# Altium schematic sheet AnchorBoard_SNS_Power.SchDoc
size A3; Date: 25.03.2015; Author: bunto1; DrawnBy: bunto1; Organization: BFH; Address1: Berner Fachhochschule; Address2: Technik und Informatik; Address3: Höheweg 80; Address4: 2501 Biel/Bienne; DocumentNumber: 1; Revision: 1.1; SheetNumber: 1; SheetTotal: 2; CurrentDate: 25.03.2016
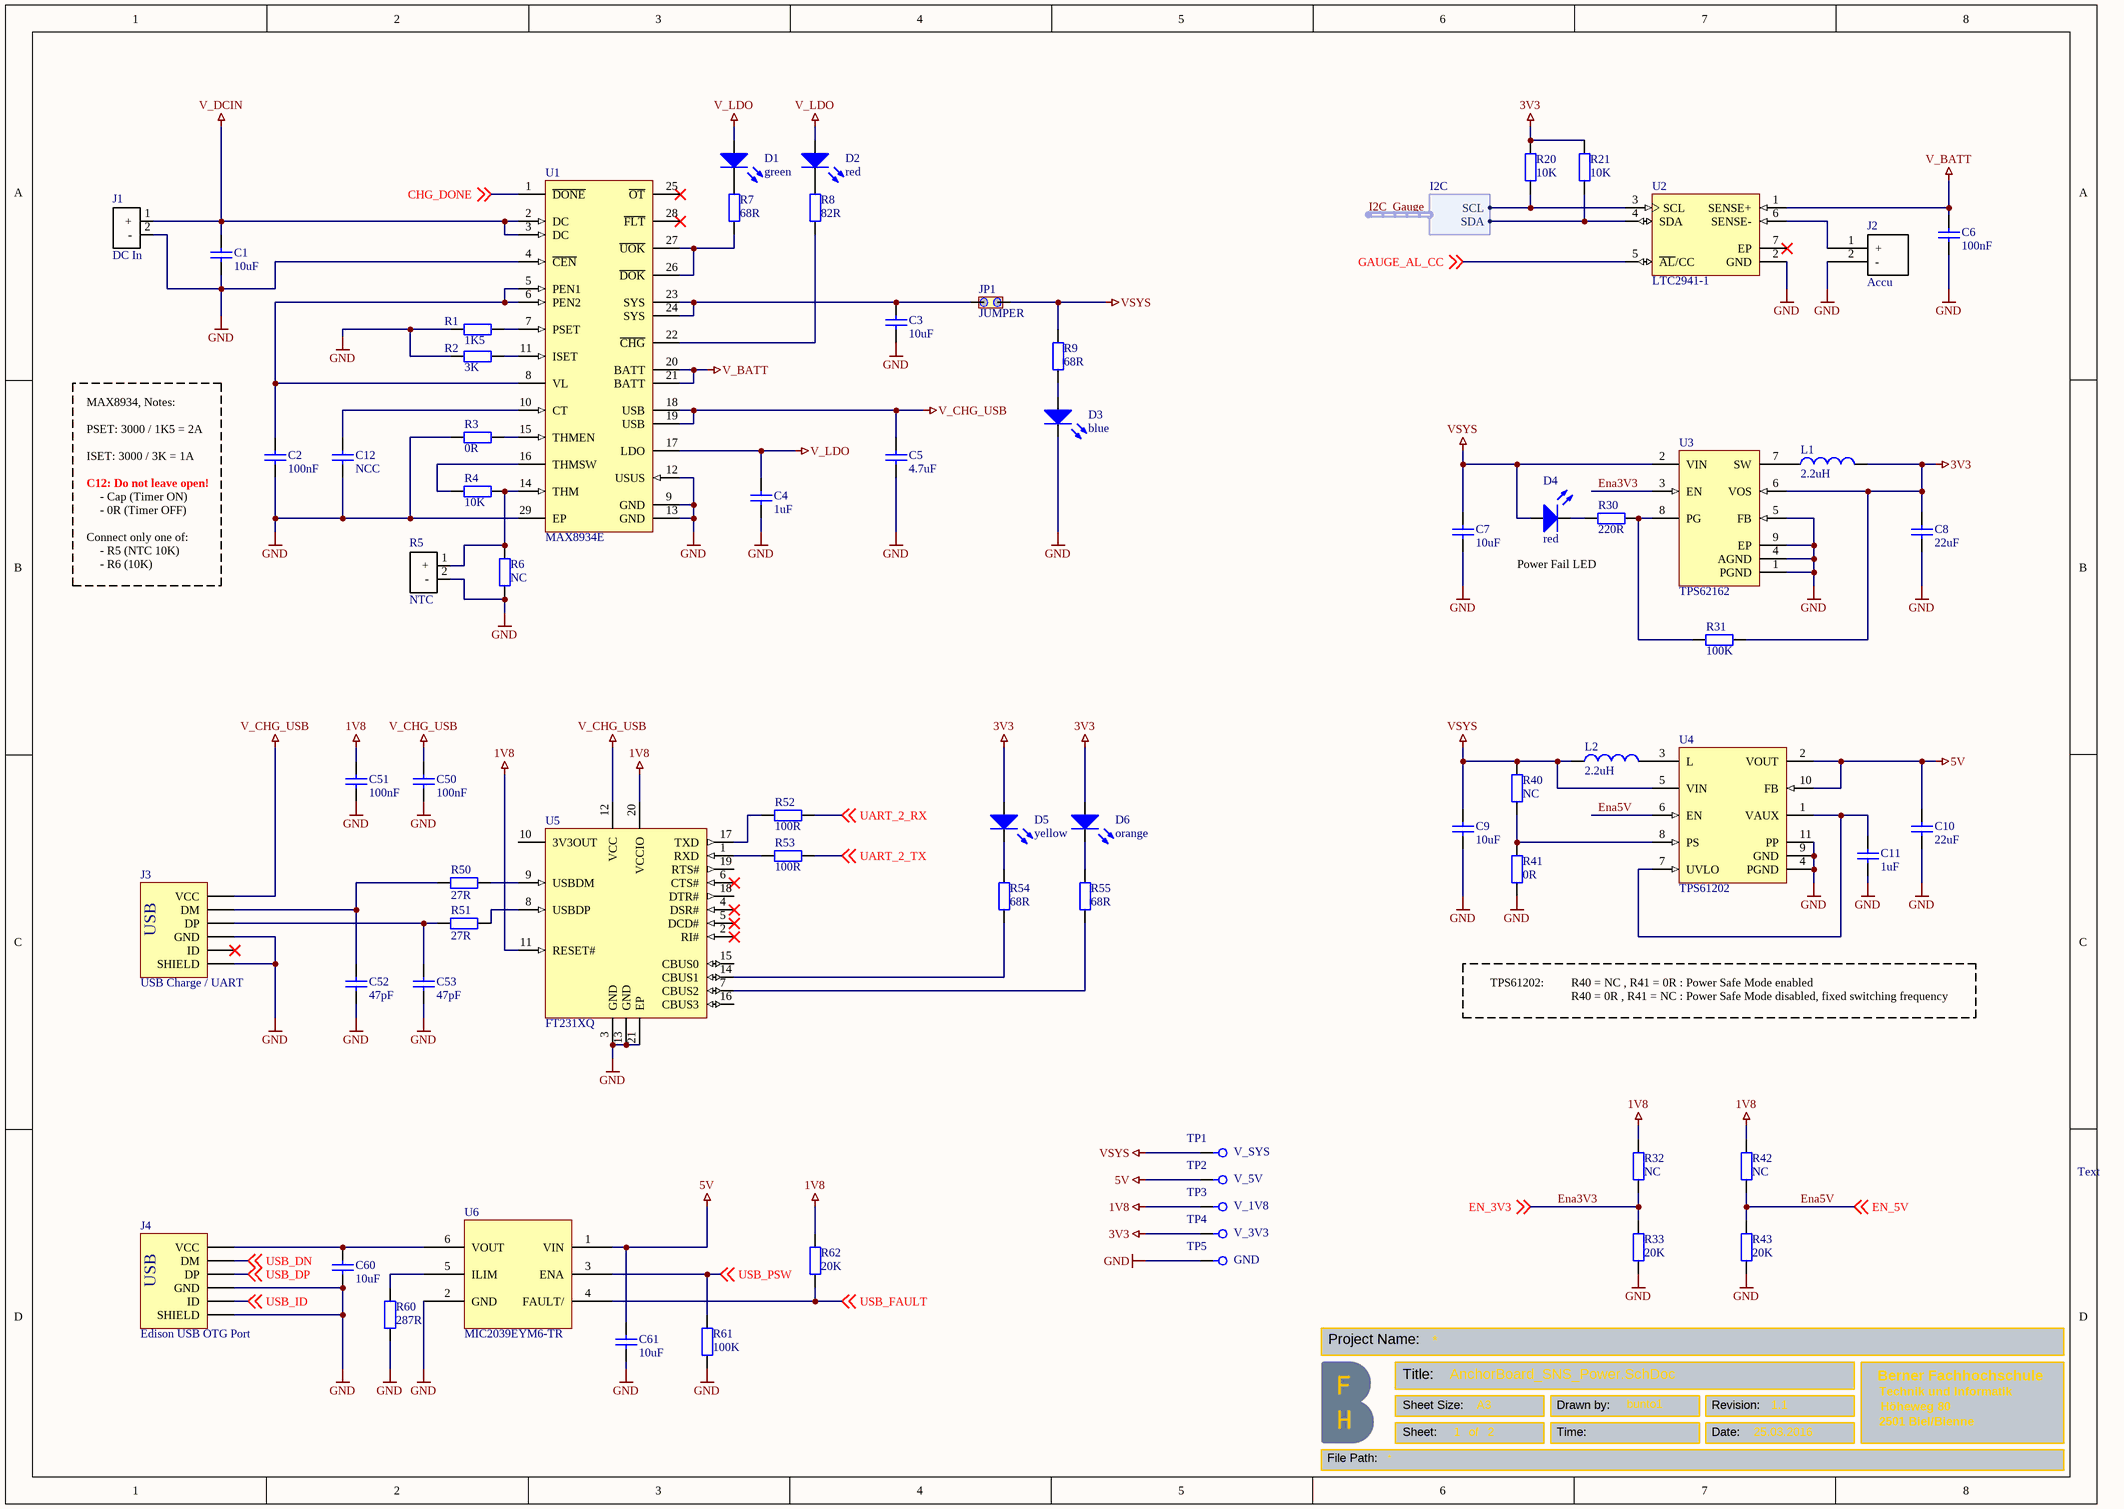
[diagram p0: AnchorBoard_SNS_Power.SchDoc]

## Parts
C1  10uF  [CAPC1608X80]
C2  100nF  [CAPC1005X50]
C3  10uF  [CAPC1608X80]
C4  1uF  [CAPC1005X50]
C5  4.7uF  [CAPC1608X80]
C6  100nF  [CAPC1005X50]
C7  10uF  [CAPC1608X80]
C8  22uF  [CAPC1608X80]
C9  10uF  [CAPC1608X80]
C10  22uF  [CAPC1608X80]
C11  1uF  [CAPC1005X50]
C12  NCC  [RESC1005X35]
C50  100nF  [CAPC1005X50]
C51  100nF  [CAPC1005X50]
C52  47pF  [CAPC1005X50]
C53  47pF  [CAPC1005X50]
C60  10uF  [CAPC1608X80]
C61  10uF  [CAPC1608X80]
D1  green  [LEDM1608X80]
D2  red  [LEDM1608X80]
D3  blue  [LEDM1608X80]
D4  red  [LEDM1608X80]
D5  yellow  [LEDM1608X80]
D6  orange  [LEDM1608X80]
J1  DC In  [ACCU_PORT]
J2  Accu  [ACCU_PORT]
J3  USB Charge / UART  [MOLEX_0473460001]
J4  Edison USB OTG Port  [MOLEX_0473460001]
JP1  JUMPER  [HDR1X2_V_M]
L1  2.2uH  [INDM2929X140]
L2  2.2uH  [INDM2929X140]
R1  1K5  [RESC1005X35]
R2  3K  [RESC1005X35]
R3  0R  [RESC1005X35]
R4  10K  [RESC1005X35]
R5  NTC  [ACCU_PORT]
R6  NC  [RESC1005X35]
R7  68R  [RESC1005X35]
R8  82R  [RESC1005X35]
R9  68R  [RESC1005X35]
R20  10K  [RESC1005X35]
R21  10K  [RESC1005X35]
R30  220R  [RESC1005X35]
R31  100K  [RESC1005X35]
R32  NC  [RESC1005X35]
R33  20K  [RESC1005X35]
R40  NC  [RESC1005X35]
R41  0R  [RESC1005X35]
R42  NC  [RESC1005X35]
R43  20K  [RESC1005X35]
R50  27R  [RESC1005X35]
R51  27R  [RESC1005X35]
R52  100R  [RESC1005X35]
R53  100R  [RESC1005X35]
R54  68R  [RESC1005X35]
R55  68R  [RESC1005X35]
R60  287R  [RESC1005X35]
R61  100K  [RESC1005X35]
R62  20K  [RESC1005X35]
TP1  V_SYS  [TP_THT]
TP2  V_5V  [TP_THT]
TP3  V_1V8  [TP_THT]
TP4  V_3V3  [TP_THT]
TP5  GND  [TP_THT]
U1  MAX8934E  [QFN40P40X40X80-29]
U2  LTC2941-1  [DFN30X20X80-6]
U3  TPS62162  [SON50P210X210X80-9]
U4  TPS61202  [SON50P310X310X100-11]
U5  FT231XQ  [QFN50P40X40X80-21]
U6  MIC2039EYM6-TR  [SOT95P360X130-6]

## Harnesses
I2C: SCL, SDA

## Nets
1V8: C51.2 R32.2 R42.2 R62.1 TP3.1(TP) U5.11(RESET#) U5.20(VCCIO)
3V3: C8.2 D5.1(A) D6.1(A) L1.2 R20.1 R21.1 R31.2 TP4.1(TP) U3.6(VOS)
5V: C10.2 C61.2 TP2.1(TP) U4.2(VOUT) U4.10(FB) U6.1(VIN)
GND: C1.1 C2.1 C3.1 C4.1 C5.1 C6.1 C7.1 C8.1 C9.1 C10.1 C11.1 C12.1 C50.1 C51.1 C52.1 C53.1 C60.1 C61.1 D3.2(K) J1.2(-) J2.2(-) J3.5(GND) J3.6(SHIELD) J4.5(GND) J4.6(SHIELD) R1.2 R2.2 R3.1 R5.2(-) R6.2 R33.2 R41.1 R43.2 R60.2 R61.2 TP5.1(TP) U1.4(~{CEN}) U1.9(GND) U1.12(USUS) U1.13(GND) U1.29(EP) U2.2(GND) U3.1(PGND) U3.4(AGND) U3.5(FB) U3.9(EP) U4.4(PGND) U4.9(GND) U4.11(PP) U5.3(GND) U5.13(GND) U5.21(EP) U6.2(GND)
V_BATT: C6.2 U1.20(BATT) U1.21(BATT) U2.1(SENSE+)
V_CHG_USB: C5.2 C50.2 J3.1(VCC) U1.18(USB) U1.19(USB) U5.12(VCC)
V_DCIN: C1.2 J1.1(+) U1.2(DC) U1.3(DC)
V_LDO: C4.2 D1.1(A) D2.1(A) U1.17(LDO)
VSYS: C7.2 C9.2 D4.1(A) JP1.2 L2.1 R9.1 R40.2 TP1.1(TP) U3.2(VIN) U4.5(VIN)
CHG_DONE: U1.1(~{DONE}) ; off-sheet CHG_DONE
Ena3V3: R32.1 R33.1 U3.3(EN) ; off-sheet EN_3V3  [also labelled EN_3V3]
Ena5V: R42.1 R43.1 U4.6(EN) ; off-sheet EN_5V  [also labelled EN_5V]
GAUGE_AL_CC: U2.5(~{AL}/CC) ; off-sheet GAUGE_AL_CC
I2C_Gauge.SCL: R20.2 U2.3(SCL) ; harness I2C.SCL
I2C_Gauge.SDA: R21.2 U2.4(SDA) ; harness I2C.SDA
UART_2_RX: R52.1 ; off-sheet UART_2_RX
UART_2_TX: R53.1 ; off-sheet UART_2_TX
USB_DN: J4.2(DM) ; off-sheet USB_DN
USB_DP: J4.3(DP) ; off-sheet USB_DP
USB_FAULT: R62.2 U6.4(FAULT/) ; off-sheet USB_FAULT
USB_ID: J4.4(ID) ; off-sheet USB_ID
USB_PSW: R61.1 U6.3(ENA) ; off-sheet USB_PSW
NetC2_2: C2.2 U1.5(PEN1) U1.6(PEN2) U1.8(VL)
NetC3_2: C3.2 JP1.1 U1.23(SYS) U1.24(SYS)
NetC11_2: C11.2 U4.1(VAUX) U4.7(UVLO)
NetC12_2: C12.2 U1.10(CT)
NetC52_2: C52.2 J3.2(DM) R50.1
NetC53_2: C53.2 J3.3(DP) R51.1
NetC60_2: C60.2 J4.1(VCC) U6.6(VOUT)
NetD1_2: D1.2(K) R7.1
NetD2_2: D2.2(K) R8.2
NetD3_1: D3.1(A) R9.2
NetD4_2: D4.2(K) R30.1
NetD5_2: D5.2(K) R54.1
NetD6_2: D6.2(K) R55.2
NetJ2_1: J2.1(+) U2.6(SENSE-)
NetL1_1: L1.1 U3.7(SW)
NetL2_2: L2.2 U4.3(L)
NetR1_1: R1.1 U1.7(PSET)
NetR2_1: R2.1 U1.11(ISET)
NetR3_2: R3.2 U1.15(THMEN)
NetR4_1: R4.1 R5.1(+) R6.1 U1.14(THM)
NetR4_2: R4.2 U1.16(THMSW)
NetR7_2: R7.2 U1.26(~{DOK}) U1.27(~{UOK})
NetR8_1: R8.1 U1.22(~{CHG})
NetR30_2: R30.2 R31.1 U3.8(PG)
NetR40_1: R40.1 R41.2 U4.8(PS)
NetR50_2: R50.2 U5.9(USBDM)
NetR51_2: R51.2 U5.8(USBDP)
NetR52_2: R52.2 U5.17(TXD)
NetR53_2: R53.2 U5.1(RXD)
NetR54_2: R54.2 U5.14(CBUS1)
NetR55_1: R55.1 U5.7(CBUS2)
NetR60_1: R60.1 U6.5(ILIM)

Not connected (* = marked no-connect by the designer): J3 4(ID)*; U1 25(~{OT})* 28(~{FLT})*; U2 7(EP)*; U5 2(RI#)* 4(DSR#)* 5(DCD#)* 6(CTS#)* 10(3V3OUT) 15(CBUS0) 16(CBUS3) 18(DTR#) 19(RTS#)

## Notes on the sheet
- PSET: 3000 / 1K5 = 2A
- MAX8934, Notes:
- ISET: 3000 / 3K = 1A
- (near C2) C12: Do not leave open!
- - Cap (Timer ON)
- - 0R (Timer OFF)
- Connect only one of:
- - R5 (NTC 10K)
- - R6 (10K)
- Power Fail LED
- TPS61202:
- R40 = NC , R41 = 0R : Power Safe Mode enabled
- R40 = 0R , R41 = NC : Power Safe Mode disabled, fixed switching frequency
- Text
- Project Name:
- Title:
- File Path:
- Sheet Size:
- Sheet:
- of
- A3
- Drawn by:
- Time:
- Revision:
- Date:
- (in symbol USB_micro_B) USB

## Library data of the parts
C1 C3 C7 C9 C60 C61 = Capacitor: Capacitor SMD Ceramic X7R; Manufacturer Number: GRM188R61A106KE69D; Value: 10uF; Supplier 1: Mouser; Supplier 2: Digi-Key; Supplier Part Number 1: 81-GRM188R61A106KE9D; Supplier Part Number 2: 490-10474-1-ND
C2 C6 C50 C51 = Capacitor: Capacitor SMD; Manufacturer Number: GRM155R71A104KA01D; Value: 100nF; Supplier 1: Mouser; Supplier 2: Digi-Key; Supplier Part Number 1: 81-GRM155R71A104KA1D; Supplier Part Number 2: 490-6321-1-ND
C4 C11 = Capacitor: Capacitor SMD Ceramic X7R Low ESR; Manufacturer Number: GRM155R61A105ME15D; Value: 1uF; Supplier 1: Mouser; Supplier 2: Digi-Key; Supplier Part Number 1: 81-GRM155R61A105ME5D; Supplier Part Number 2: 490-5409-1-ND
C5 = Capacitor: Capacitor SMD Ceramic X7R; Manufacturer Number: GRM188R61A475KE15D; Value: 4.7uF; Supplier 1: Mouser; Supplier 2: Digi-Key; Supplier Part Number 1: 81-GRM188R61A475KE5D; Supplier Part Number 2: 490-10477-1-ND
C8 C10 = Capacitor: Capacitor SMD Ceramic X7R Low ESR; Manufacturer Number: GRM188R61A226ME15D; Value: 22uF; Supplier 1: Mouser; Supplier 2: Digi-Key; Supplier Part Number 1: 81-GRM188R61A226ME5D; Supplier Part Number 2: 490-10476-1-ND
C12 = Capacitor: Capacitor SMD Ceramic X7R; Value: NCC; Supplier 1: Mouser; Supplier 2: Digi-Key
C52 C53 = Capacitor: Capacitor SMD; Manufacturer Number: GRM1555C1H470FA01D; Value: 47pF; Supplier 1: Mouser; Supplier 2: Digi-Key; Supplier Part Number 1: 81-GRM1555C1H470FA1D; Supplier Part Number 2: 490-6241-1-ND
D1 = LED_green: Light Emitting Diode; Manufacturer Number: LTST-C190KGKT; Manufacturer: Lite-On; Forward_Current: 20mA; Modified_by: bunto1; Forward_Voltage: 2V; Modified: 15.04.2016; Color: green; Supplier 1: Mouser; Supplier Part Number 1: 859-LTST-C190KGKT; Supplier 2: Digi-Key; Supplier Part Number 2: 160-1435-1-ND
D2 D4 = LED_red: Light Emitting Diode; Manufacturer Number: LTST-C190KRKT; Manufacturer: Lite-On; Forward_Current: 20mA; Modified_by: bunto1; Forward_Voltage: 2V; Modified: 15.04.2016; Color: red; Supplier 1: Mouser; Supplier Part Number 1: 859-LTST-C190KRKT; Supplier 2: Digi-Key; Supplier Part Number 2: 160-1436-1-ND
D3 = LED_blue: Light Emitting Diode; Manufacturer Number: LTST-C190TBKT; Manufacturer: Lite-On; Forward_Current: 20mA; Modified_by: bunto1; Forward_Voltage: 3V; Modified: 15.04.2016; Color: blue; Supplier 1: Mouser; Supplier Part Number 1: 859-LTST-C190TBKT; Supplier 2: Digi-Key; Supplier Part Number 2: 160-1646-1-ND
D5 = LED_yellow: Light Emitting Diode; Manufacturer Number: LTST-C190KSKT; Manufacturer: Lite-On; Forward_Current: 20mA; Modified_by: bunto1; Forward_Voltage: 2V; Modified: 15.04.2016; Color: yellow; Supplier 1: Mouser; Supplier Part Number 1: 859-LTST-C190KSKT; Supplier 2: Digi-Key; Supplier Part Number 2: 160-1437-1-ND
D6 = LED_orange: Light Emitting Diode; Manufacturer Number: LTST-C190KFKT; Manufacturer: Lite-On; Forward_Current: 20mA; Modified_by: bunto1; Forward_Voltage: 2V; Modified: 15.04.2016; Color: orange; Supplier 1: Mouser; Supplier Part Number 1: 859-LTST-C190KFKT; Supplier 2: Digi-Key; Supplier Part Number 2: 160-1434-1-ND
J1 R5 = PORT_THT: 2-Pin THT Port
  J1: Value: DC In
  R5: Value: NTC
J2 = ACCU_PORT: Accu Port
J3 J4 = USB_micro_B: USB Connectors MICRO USB B RECPT; Manufacturer Number: 47346-0001; Supplier 1: Mouser; Supplier Part Number 1: 538-47346-0001; Supplier 2: Digi-Key; Supplier Part Number 2: WM17141CT-ND
L1 L2 = L: Inductor; Manufacturer Number: LPS3015-222MRC; Modified_by: BEP; Modified: 10.2008; Value: 2.2uH; Supplier 2: Digi-Key; Supplier 1: Mouser; Supplier Part Number 1: 994-LPS3015-222MRC
R1 = Resistor: Manufacturer Number: ERJ-2RKF1501X; Value: 1K5; Supplier 2: Digi-Key; Supplier 1: Mouser; Supplier Part Number 1: 667-ERJ-2RKF1501X; Supplier Part Number 2: P1.50KLCT-ND
R2 = Resistor: Manufacturer Number: ERJ-2RKF3001X; Value: 3K; Supplier 2: Digi-Key; Supplier 1: Mouser; Supplier Part Number 1: 667-ERJ-2RKF3001X; Supplier Part Number 2: P3.00KLCT-ND
R3 R41 = Resistor: Manufacturer Number: ERJ-2GE0R00X; Value: 0R; Supplier 1: Mouser; Supplier 2: Digi-Key; Supplier Part Number 1: 667-ERJ-2GE0R00X; Supplier Part Number 2: P0.0JCT-ND
R4 R20 R21 = Resistor: Manufacturer Number: ERJ-2RKF1002X; Value: 10K; Supplier 2: Digi-Key; Supplier 1: Mouser; Supplier Part Number 1: 667-ERJ-2RKF1002X; Supplier Part Number 2: P10.0KLCT-ND
R6 R32 R40 R42 = Resistor: Value: NC; Supplier 2: Digi-Key; Supplier 1: Mouser
R7 R9 R54 R55 = Resistor: Manufacturer Number: ERJ-2RKF68R0X; Value: 68R; Supplier 1: Mouser; Supplier 2: Digi-Key; Supplier Part Number 1: 667-ERJ-2RKF68R0X; Supplier Part Number 2: P68.0LCT-ND
R8 = Resistor: Manufacturer Number: ERJ-2RKF82R0X; Value: 82R; Supplier 1: Mouser; Supplier 2: Digi-Key; Supplier Part Number 1: 667-ERJ-2RKF82R0X; Supplier Part Number 2: P82.0LCT-ND
R30 = Resistor: Manufacturer Number: ERJ-2RKF2200X; Value: 220R; Supplier 1: Mouser; Supplier 2: Digi-Key; Supplier Part Number 1: 667-ERJ-2RKF2200X; Supplier Part Number 2: P220LCT-ND
R31 R61 = Resistor: Manufacturer Number: ERJ-2RKF1003X; Value: 100K; Supplier 2: Digi-Key; Supplier 1: Mouser; Supplier Part Number 1: 667-ERJ-2RKF1003X; Supplier Part Number 2: P100KLCT-ND
R33 R43 R62 = Resistor: Manufacturer Number: ERJ-2RKF2002X; Value: 20K; Supplier Part Number 1: 667-ERJ-2RKF2002X; Supplier Part Number 2: P20.0KLCT-ND; Supplier 2: Digi-Key; Supplier 1: Mouser
R50 R51 = Resistor: Manufacturer Number: ERJ-2RKF27R0X; Value: 27R; Supplier 1: Mouser; Supplier 2: Digi-Key; Supplier Part Number 1: 667-ERJ-2RKF27R0X; Supplier Part Number 2: P27.0LCT-ND
R52 R53 = Resistor: Manufacturer Number: ERJ-2RKF1000X; Value: 100R; Supplier 1: Mouser; Supplier 2: Digi-Key; Supplier Part Number 1: 667-ERJ-2RKF1000X; Supplier Part Number 2: P100LCT-ND
R60 = Resistor: Manufacturer Number: ERJ-2RKF2870X; Value: 287R; Supplier 2: Digi-Key; Supplier 1: Mouser; Supplier Part Number 1: 667-ERJ-2RKF2870X; Supplier Part Number 2: P287LCT-ND
TP1-TP5 = TP1: Test-Point; Values: *; Order Nbr: *; Distributor: *; Manufacturer: *; Divers: *; Price: *; Marking: *
U1 = MAX8934E: IC BATTERY CHARGER DUAL 28TQFN; Manufacturer Number: MAX8934EETI+; Supplier 2: Digi-Key; Supplier 1: Mouser; Supplier Part Number 1: 700-MAX8934EETI+; Supplier Part Number 2: MAX8934EETI+-ND
U2 = LTC2941-1: IC FUEL/GAS GAUGE LI-ION 1A 6DFN; Manufacturer Number: LTC2941IDCB-1#TRMPBF; Value: LTC2941-1; Supplier 2: Digi-Key; Supplier Part Number 2: LTC2941IDCB-1#TRMPBFCT-ND; Supplier 1: Mouser
U3 = TPS62162: IC REG BUCK 3.3V 1A SYNC 8WSON; Manufacturer Number: TPS62162DSGR; Supplier 1: Mouser; Supplier 2: Digi-Key; Value: TPS62162; Supplier Part Number 2: 296-43671-1-ND; Supplier Part Number 1: 595-TPS62162DSGR
U4 = TPS61202: IC REG BOOST 5V 1.2A SYNC 10SON; Manufacturer Number: TPS61202DRCR; Supplier 1: Mouser; Supplier 2: Digi-Key; Value: TPS61202; Supplier Part Number 1: 595-TPS61202DRCR; Supplier Part Number 2: 296-27462-1-ND
U5 = FT231XQ: IC USB SERIAL FULL UART 20QFN; Manufacturer Number: FT231XQ-R; Supplier 2: Digi-Key; Supplier 1: Mouser; Supplier Part Number 1: 895-FT231XQ-R; Supplier Part Number 2: 768-1128-1-ND
U6 = MIC2039: Adjustable Current Limit Power Switch; Supplier Part Number 1: 998-MIC2039EYM6TR; Supplier 1: Mouser; Manufacturer Number: MIC2039EYM6; Supplier 2: Digi-Key; Supplier Part Number 2: 576-4192-1-ND
JP1 = JUMPER: Values: *; Order Nbr: *; Distributor: *; Manufacturer: *; Divers: *; Price: *; Marking: *